# EAGLE design start (EAGLE 6.5.0)
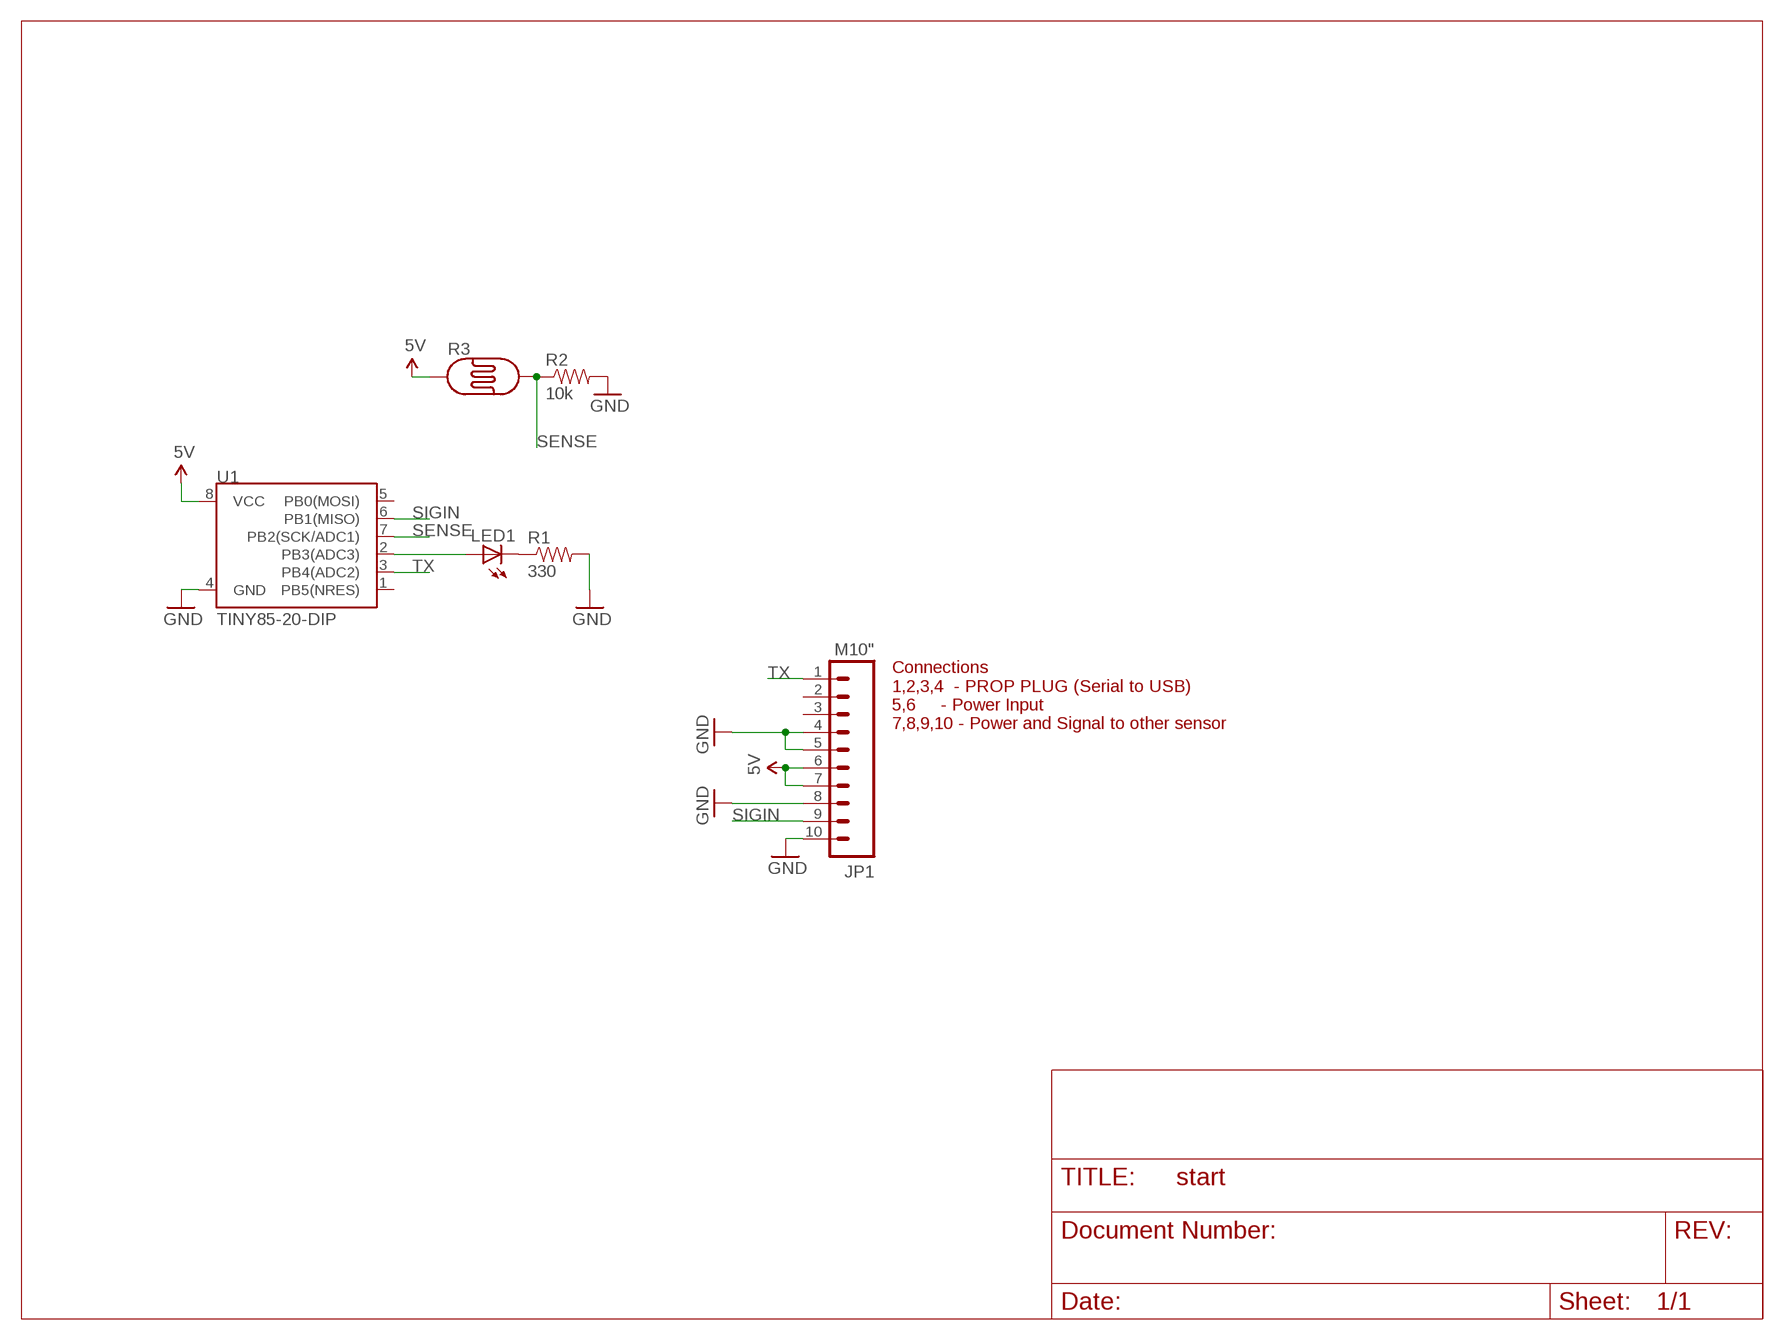
[diagram p0: schematic, sheet 1]

## Parts
JP1  M10"  [1X10]
LED1  LED5MM  [LED5MM]
R1  330  RESISTORPTH-1/4W  [AXIAL-0.4]
R2  10k  RESISTORPTH-1/4W  [AXIAL-0.4]
R3  PHOTOCELLPTH  [PHOTOCELL]
U1  TINY85-20-DIP  ATTINY45TINY85-20-DIP  [DIP08]

## Nets
5V: JP1.6 JP1.7 R3.1 U1.8(VCC)
GND: JP1.4 JP1.5 JP1.8 JP1.10 R1.P$2 R2.P$2 U1.4(GND)
N$4: LED1.K(C) R1.P$1
N$5: LED1.A U1.2(PB3(ADC3))
SENSE: R2.P$1 R3.2 U1.7(PB2(SCK/ADC1))
SIGIN: JP1.9 U1.6(PB1(MISO))
TX: JP1.1 U1.3(PB4(ADC2))
Unconnected: JP1.2 JP1.3 U1.1(PB5(NRES)) U1.5(PB0(MOSI))

## Notes on the sheet
- Connections
  1,2,3,4  - PROP PLUG (Serial to USB)
  5,6     - Power Input
  7,8,9,10 - Power and Signal to other sensor

## Library data of the parts
JP1 = SparkFun-Connectors:M10: Header 10 Standard 10-pin 0.1" header. Use with straight break away headers (SKU : PRT-00116), right angle break away headers (PRT-00553), swiss pins (PRT-00743), machine pins (PRT-00117), and female headers (PRT-00115).
LED1 = SparkFun-LED:LED: LEDs Standard schematic elements and footprints for 5mm, 3mm, 1206, and 0603 sized LEDs. 5mm - Spark Fun Electronics SKU : COM-00529 (and others)
R1 R2 = SparkFun-Resistors:RESISTOR: Resistor Basic schematic elements and footprints for 0603, 1206, and PTH resistors.
R3 = SparkFun-Sensors:PHOTOCELL: CdS photoresistor. This is a low cost way to detect light levels. Resistance decreases with more incoming light. SparkFun SKU: SEN-09088
U1 = SparkFun-DigitalIC:ATTINY45: Atmel 8-pin 2/4/8kB flash uC; PROD_ID: IC-09445

## Board
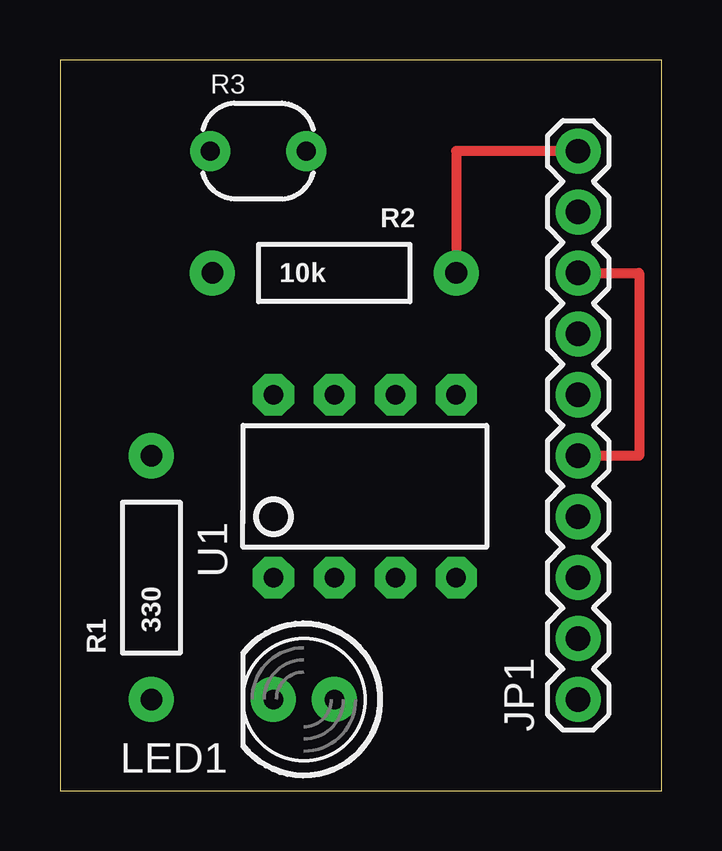
[diagram p1: board, top side]
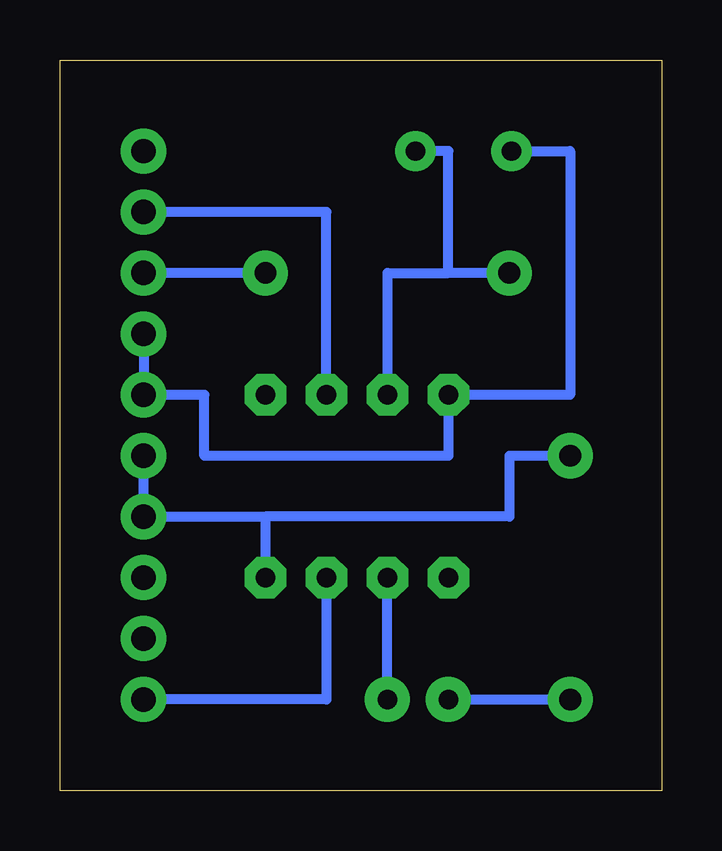
[diagram p2: board, bottom side, seen from below]

Size 25.07 x 30.47 mm. Coordinates in mm from the lower left corner, seen from the top.
Outline: 0,0 25.07,0 25.07,30.47 0,30.47 0,0
Copper layers (1*16): Top 0.035mm / dielectric 1.5mm / Bottom 0.035mm
Design rules "default": minimum track width 10mil, minimum drill 24mil, track to track 8mil, track to pad 8mil, pad to pad 8mil, via to via 8mil, smd to smd 8mil, copper to edge 40mil, drill to drill 8mil, minimum pad ring 10mil, minimum via ring 8mil, stop-mask expansion 4mil, vias tented up to drill 0mil, thermal gap 10mil

### Footprints (pad centres in the part's own frame; a part is rotated, then mirrored left to right if it is on the bottom)
1X10 = drill 1.016 pad 1.88: 1 0,0; 2 2.54,0; 3 5.08,0; 4 7.62,0; 5 10.16,0; 6 12.7,0; 7 15.24,0; 8 17.78,0; 9 20.32,0; 10 22.86,0
LED5MM = drill 0.813 pad 1.88: A -1.27,0; K 1.27,0
AXIAL-0.4 = drill 0.9 pad 1.88: P$1 -5.08,0; P$2 5.08,0
PHOTOCELL = drill 0.8 pad 1.676: 1 -2,0; 2 2,0
DIP08 = drill 0.813 pad 1.727 octagon: 1 -3.81,-3.81; 2 -1.27,-3.81; 3 1.27,-3.81; 4 3.81,-3.81; 5 3.81,3.81; 6 1.27,3.81; 7 -1.27,3.81; 8 -3.81,3.81

### Placement (x,y rotation side)
JP1  21.59,3.81 90 top
LED1  10.16,3.81 180 top
R1  3.81,8.89 90 top
R2  11.43,21.59 0 top
R3  8.26,26.67 0 top
U1  12.7,12.7 0 top

### Tracks (layer width: path | path; a pad name or v marks a point on that pad's centre or on a via)
5V
  Bottom 0.406: R3.1 3.81,26.67 3.81,16.51 U1.8 8.89,13.97 19.05,13.97 19.05,16.51 JP1.6 JP1.7
GND
  Top 0.406: JP1.10 16.51,26.67 R2.P$2 | JP1.8 24.13,21.59 24.13,13.97 JP1.5
  Bottom 0.406: R1.P$2 6.35,13.97 6.35,11.43 16.51,11.43 | 16.51,11.43 JP1.4 JP1.5 | 16.51,11.43 U1.4 | R2.P$2 JP1.8
N$4
  Bottom 0.406: LED1.K R1.P$1
N$5
  Bottom 0.406: LED1.A U1.2
SENSE
  Bottom 0.406: R2.P$1 8.89,21.59 | U1.7 11.43,21.59 8.89,21.59 | 8.89,21.59 8.89,26.67 R3.2
SIGIN
  Bottom 0.406: U1.6 13.97,24.13 JP1.9
TX
  Bottom 0.406: U1.3 13.97,3.81 JP1.1